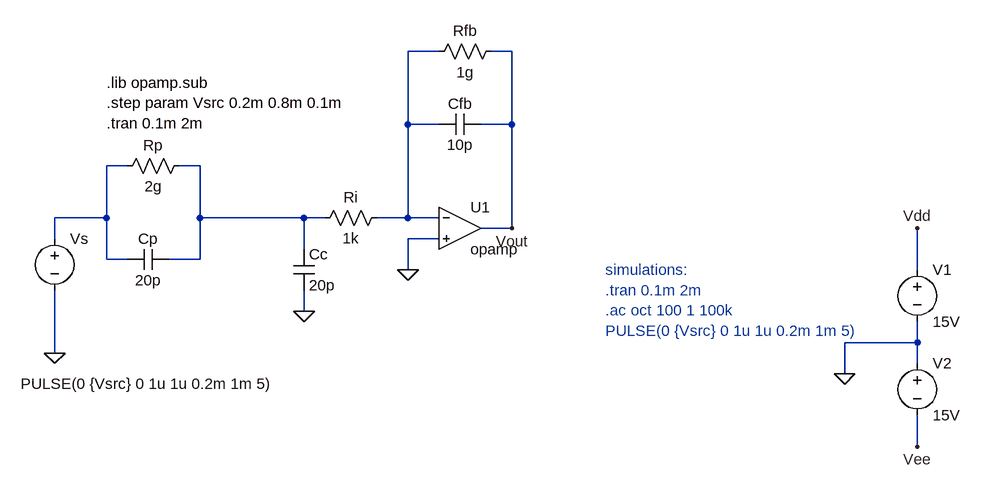
[diagram p0: schematic ChargeAmplifier2.asc]
ChargeAmplifier2.asc, the LTspice schematic file:
Version 4
SHEET 1 1256 680
WIRE 448 -96 400 -96
WIRE 560 -96 528 -96
WIRE 400 16 400 -96
WIRE 448 16 400 16
WIRE 560 16 560 -96
WIRE 560 16 512 16
WIRE -32 80 -64 80
WIRE 80 80 48 80
WIRE -64 160 -64 80
WIRE -64 160 -144 160
WIRE 80 160 80 80
WIRE 240 160 80 160
WIRE 272 160 240 160
WIRE 400 160 400 16
WIRE 400 160 352 160
WIRE 448 160 400 160
WIRE 560 176 560 16
WIRE 560 176 512 176
WIRE -144 192 -144 160
WIRE 448 192 400 192
WIRE 240 208 240 160
WIRE -64 224 -64 160
WIRE -32 224 -64 224
WIRE 80 224 80 160
WIRE 80 224 32 224
WIRE 400 240 400 192
WIRE 1184 240 1184 176
WIRE 240 304 240 272
WIRE 1184 352 1184 320
WIRE 1184 352 1072 352
WIRE -144 368 -144 272
WIRE 1184 384 1184 352
WIRE 1072 400 1072 352
WIRE 1184 512 1184 464
FLAG 400 240 0
FLAG 560 176 Vout
FLAG 1072 400 0
FLAG 1184 176 Vdd
FLAG 1184 512 Vee
FLAG 240 304 0
FLAG -144 368 0
SYMBOL cap 512 0 R90
WINDOW 0 0 32 VBottom 2
WINDOW 3 32 32 VTop 2
SYMATTR InstName Cfb
SYMATTR Value 10p
SYMBOL res 544 -112 R90
WINDOW 0 0 56 VBottom 2
WINDOW 3 32 56 VTop 2
SYMATTR InstName Rfb
SYMATTR Value 1g
SYMBOL res 368 144 R90
WINDOW 0 0 56 VBottom 2
WINDOW 3 32 56 VTop 2
SYMATTR InstName Ri
SYMATTR Value 1k
SYMBOL voltage 1184 224 R0
SYMATTR InstName V1
SYMATTR Value 15V
SYMBOL voltage 1184 368 R0
SYMATTR InstName V2
SYMATTR Value 15V
SYMBOL Opamps/opamp 480 112 R0
SYMATTR InstName U1
SYMBOL cap 224 208 R0
SYMATTR InstName Cc
SYMATTR Value 20p
SYMBOL voltage -144 176 R0
WINDOW 3 -52 239 Left 2
SYMATTR Value PULSE(0 {Vsrc} 0 1u 1u 0.2m 1m 5)
SYMATTR InstName Vs
SYMATTR Value2 AC 1m
SYMBOL cap 32 208 R90
WINDOW 0 0 32 VBottom 2
WINDOW 3 32 32 VTop 2
SYMATTR InstName Cp
SYMATTR Value 20p
SYMBOL res 64 64 R90
WINDOW 0 0 56 VBottom 2
WINDOW 3 32 56 VTop 2
SYMATTR InstName Rp
SYMATTR Value 2g
TEXT -64 -48 Left 2 !.lib opamp.sub\n.step param Vsrc 0.2m 0.8m 0.1m\n.tran 0.1m 2m
TEXT 704 240 Left 2 ;simulations:\n.tran 0.1m 2m\n.ac oct 100 1 100k\nPULSE(0 {Vsrc} 0 1u 1u 0.2m 1m 5)

The netlist it stands for:
* ChargeAmplifier2.asc
Cfb Vout N001 10p
Rfb Vout N001 1g
Ri N001 N003 1k
V1 Vdd 0 15V
V2 0 Vee 15V
XU1 N001 0 Vout opamp Aol=100K GBW=10Meg  ; pins invin noninvin out
Cc N003 0 20p
Vs N002 0 PULSE(0 {Vsrc} 0 1u 1u 0.2m 1m 5) AC 1m
Cp N003 N002 20p
Rp N003 N002 2g
.lib opamp.sub
.step param Vsrc 0.2m 0.8m 0.1m
.tran 0.1m 2m
* simulations:
* .tran 0.1m 2m
* .ac oct 100 1 100k
* PULSE(0 {Vsrc} 0 1u 1u 0.2m 1m 5)
.backanno
.end